# EAGLE design DeadHorsePCB_REV-B (EAGLE 8.6.1)
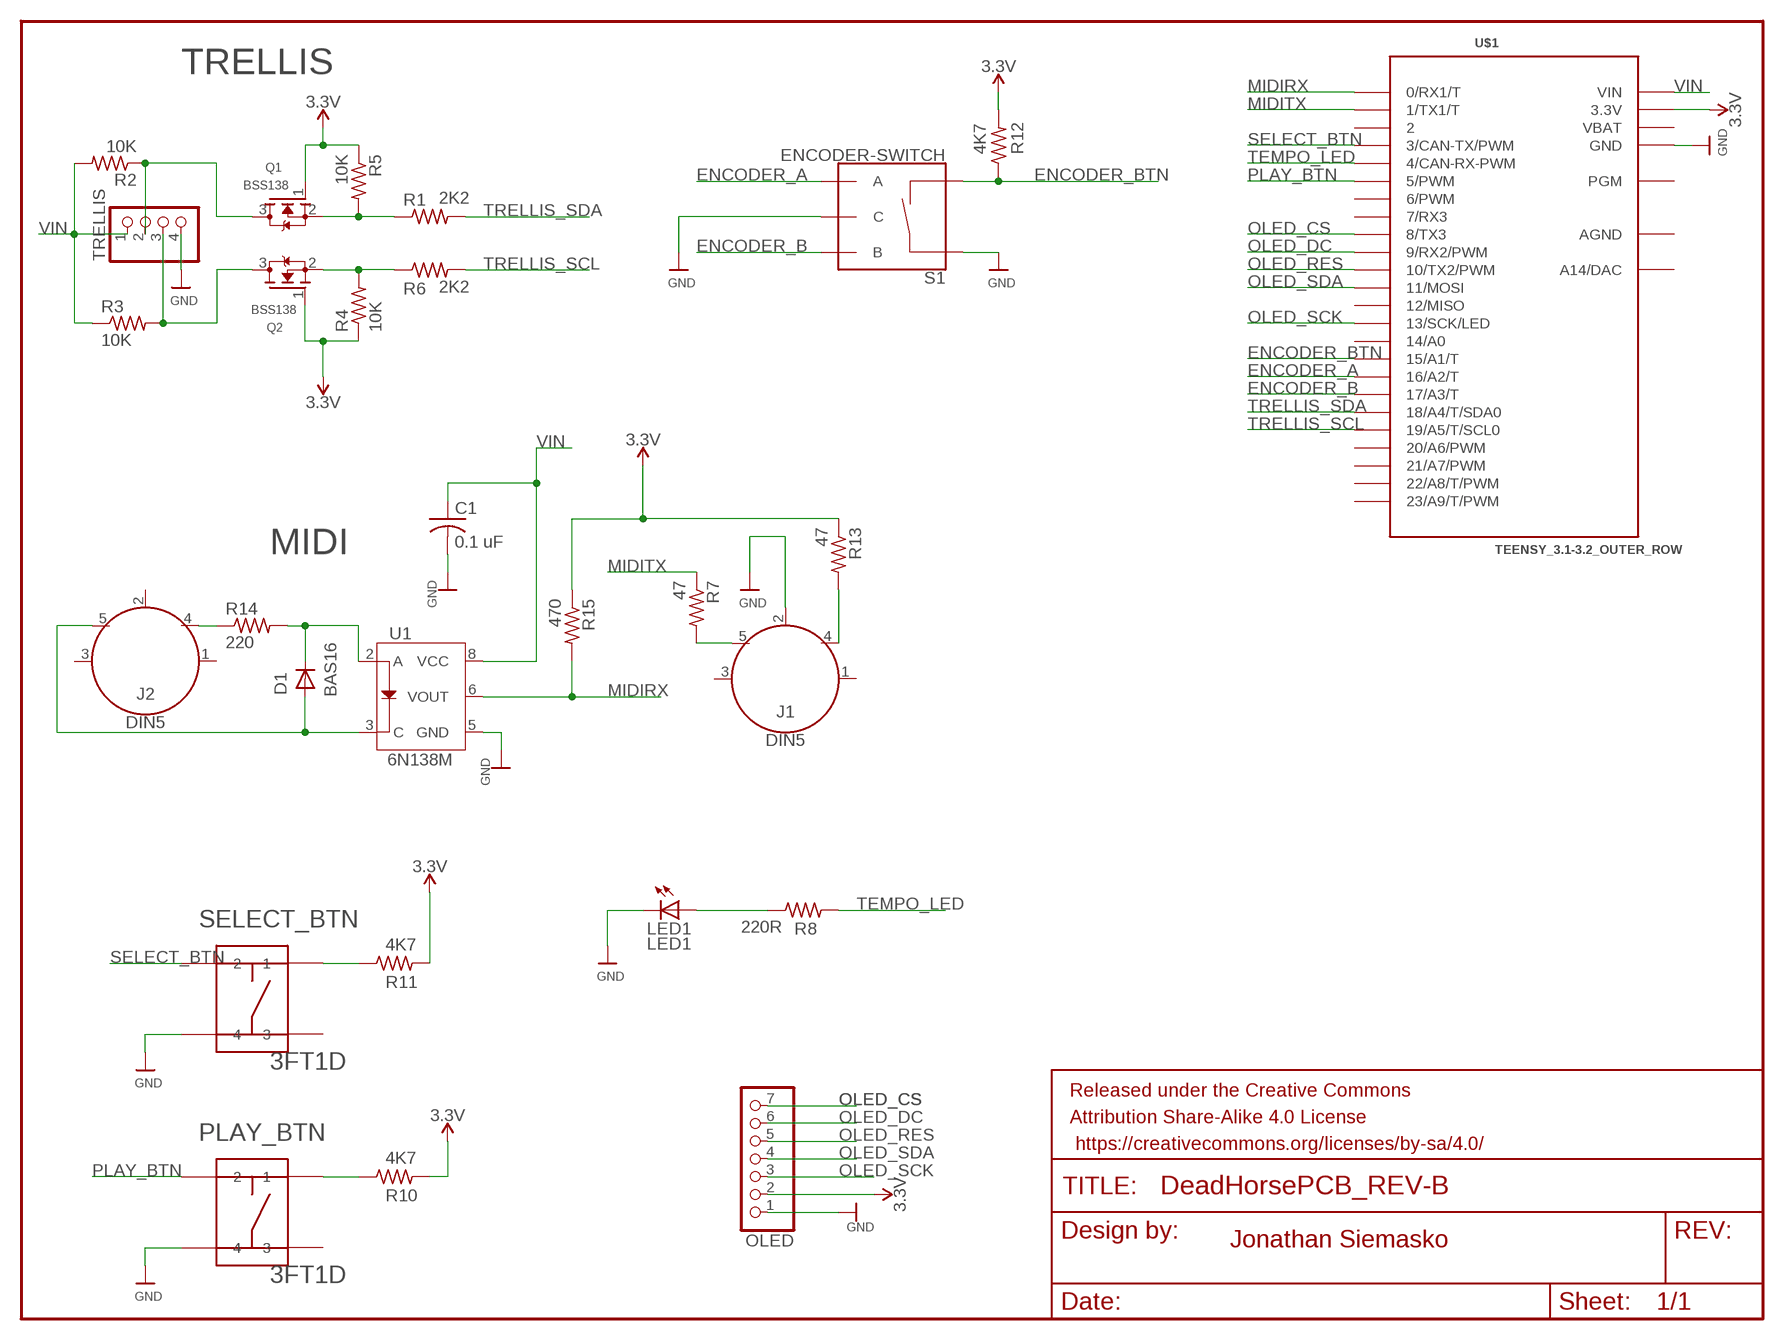
[diagram p0: schematic, sheet 1]

## Parts
C1  0.1 uF  C-USC0805  [C0805]
D1  BAS16  [SOT23]
FRAME1  FRAME-LETTER  [CREATIVE_COMMONS]
J1  DIN5  [DIN5-RA-PTH]
J2  DIN5  [DIN5-RA-PTH]
LED1  LED1  LED5MM  [LED5MM]
OLED  OLED  PINHD-1X7  [1X07]
PLAY_BTN  3FT1D  [3FT]
Q1  BSS138  MOSFET-NREFLOW  [SOT23]
Q2  BSS138  MOSFET-NREFLOW  [SOT23]
R1  2K2  R-US_R0805  [R0805]
R2  10K  R-US_R0805  [R0805]
R3  10K  R-US_R0805  [R0805]
R4  10K  R-US_R0805  [R0805]
R5  10K  R-US_R0805  [R0805]
R6  2K2  R-US_R0805  [R0805]
R7  47  R-US_R0805  [R0805]
R8  220R  R-US_R0805  [R0805]
R10  4K7  R-US_R0805  [R0805]
R11  4K7  R-US_R0805  [R0805]
R12  4K7  R-US_R0805  [R0805]
R13  47  R-US_R0805  [R0805]
R14  220  R-US_R0805  [R0805]
R15  470  R-US_R0805  [R0805]
S1  ENCODER-SWITCH  [ROTARY_ENC_PLAIN]
SELECT_BTN  3FT1D  [3FT]
TRELLIS  TRELLIS  PINHD-1X4  [1X04]
U1  6N138M  OPTO_DARL_6N138S  [8-SMD]
U$1  TEENSY_3.1-3.2_OUTER_ROW  [TEENSY_3.0-3.2&LC_OUTER_ROW]

## Nets
3.3V [3v3 supply]: OLED.2 Q1.1(G) Q2.1(G) R4.1 R5.1 R10.2 R11.2 R12.2 R13.1 R15.1 U$1.3.3V U$1.3.3V1(3.3V)
ENCODER_A: S1.A U$1.16/A2(16/A2/T)
ENCODER_B: S1.B U$1.17/A3(17/A3/T)
ENCODER_BTN: R12.1 S1.SW- U$1.15/A1(15/A1/T)
GND [supply]: C1.2 J1.2 LED1.K(C) OLED.1 PLAY_BTN.P$4 S1.C S1.SW+ SELECT_BTN.P$4 TRELLIS.4 U1.5(GND) U$1.GND U$1.GND1(GND)
MIDIRX: R15.2 U1.6(VOUT) U$1.0(0/RX1/T)
MIDITX: R7.1 U$1.1(1/TX1/T)
N$1: LED1.A R8.1
N$2: Q1.3(D) R2.1 TRELLIS.2
N$3: J1.4 R13.2
N$4: J1.5 R7.2
N$5: Q1.2(S) R1.1 R5.2
N$6: J2.4 R14.1
N$7: D1.3(K) R14.2 U1.2(A)
N$8: Q2.3(D) R3.2 TRELLIS.3
N$9: D1.1(A) J2.5 U1.3(C)
N$10: R11.1 SELECT_BTN.P$1
N$11: PLAY_BTN.P$1 R10.1
N$12: Q2.2(S) R4.2 R6.1
OLED_CS: OLED.7 U$1.8(8/TX3)
OLED_DC: OLED.6 U$1.9(9/RX2/PWM)
OLED_RES: OLED.5 U$1.10(10/TX2/PWM)
OLED_SCK: OLED.3 U$1.13(13/SCK/LED)
OLED_SDA: OLED.4 U$1.11(11/MOSI)
PLAY_BTN: PLAY_BTN.P$2 U$1.5(5/PWM)
SELECT_BTN: SELECT_BTN.P$2 U$1.3(3/CAN-TX/PWM)
TEMPO_LED: R8.2 U$1.4(4/CAN-RX-PWM)
TRELLIS_SCL: R6.2 U$1.19/A5(19/A5/T/SCL0)
TRELLIS_SDA: R1.2 U$1.18/A4(18/A4/T/SDA0)
VIN [5v supply]: C1.1 R2.2 R3.1 TRELLIS.1 U1.8(VCC) U$1.VIN
Unconnected: J1.1 J1.3 J2.1 J2.2 J2.3 PLAY_BTN.P$3 SELECT_BTN.P$3 U$1.2 U$1.6(6/PWM) U$1.7(7/RX3) U$1.12(12/MISO) U$1.14/A0 U$1.20/A6(20/A6/PWM) U$1.21/A7(21/A7/PWM) U$1.22/A8(22/A8/T/PWM) U$1.23/A9(23/A9/T/PWM) U$1.PGM U$1.RESET/DAC(A14/DAC)

## Notes on the sheet
- TRELLIS
- MIDI
- Jonathan Siemasko

## Power pins joined to a net without a drawn wire
AGND: U$1.AGND
VBAT: U$1.VBAT

## Library data of the parts
C1 = adafruit:C-US: CAPACITOR, American symbol
D1 = nxp_60:BAS16: High-speed switching diode High-speed switching diode, encapsulated in small Surface-Mounted Device (SMD) plastic packages. AAL Eindhoven MK
FRAME1 = SparkFun-Aesthetics:FRAME-LETTER: Schematic Frame - Letter Standard 8.5x11 US Letter frame
J1 J2 = SparkFun-Connectors:DIN5: DIN5 Connector - Female Right Angle (frequently used as a MIDI Jack connector) This type of connector and cable is frequently used for transmitting midi data (musical instrument digital interface). It is what you usually see on a keyboard or set of electronic drums. Learn more here <https://en.wikipedia.org/wiki/MIDI>. For more information on the pinout and electrical specifications of MIDI communications, please see the following resource: https://www.midi.org/specifications/item/midi-din-electrical-specification Here is the connector we sell at SparkFun: MIDI Connector - Female Right Angle <https://www.sparkfun.com/products/9536> (PRT-09536) Datasheet <hhttp://www.sparkfun.com/datasheets/Prototyping/Connectors/MIDI-RA.pdf> It is used on this SparkFun product: SparkFun MIDI Shield <https://www.sparkfun.com/products/12898> (DEV-12898); PROD_ID: CONN-09481
LED1 = adafruit:LED: LED OSRAM: - CHIPLED LG R971, LG N971, LY N971, LG Q971, LY Q971, LO R971, LY R971 LH N974, LH R974 LS Q976, LO Q976, LY Q976 LO Q996 - Hyper CHIPLED LW Q18S LB Q993, LB Q99A, LB R99A - SideLED LS A670, LO A670, LY A670, LG A670, LP A670 LB A673, LV A673, LT A673, LW A673 LH A674 LY A675 LS A676, LA A676, LO A676, LY A676, LW A676 LS A679, LY A679, LG A679 - Hyper Micro SIDELED® LS Y876, LA Y876, LO Y876, LY Y876 LT Y87S - SmartLED LW L88C, LW L88S LB L89C, LB L89S, LG L890 LS L89K, LO L89K, LY L89K LS L896, LA L896, LO L896, LY L896 - TOPLED LS T670, LO T670, LY T670, LG T670, LP T670 LSG T670, LSP T670, LSY T670, LOP T670, LYG T670 LG T671, LOG T671, LSG T671 LB T673, LV T673, LT T673, LW T673 LH T674 LS T676, LA T676, LO T676, LY T676, LB T676, LH T676, LSB T676, LW T676 LB T67C, LV T67C, LT T67C, LS T67K, LO T67K, LY T67K, LW E67C LS E67B, LA E67B, LO E67B, LY E67B, LB E67C, LV E67C, LT E67C LW T67C LS T679, LY T679, LG T679 LS T770, LO T770, LY T770, LG T770, LP T770 LB T773, LV T773, LT T773, LW T773 LH T774 LS E675, LA E675, LY E675, LS T675 LS T776, LA T776, LO T776, LY T776, LB T776 LHGB T686 LT T68C, LB T68C - Hyper Mini TOPLED® LB M676 - Mini TOPLED Santana® LG M470 LS M47K, LO M47K, LY M47K Source: http://www.osram.convergy.de/
OLED = pinhead:PINHD-1X7: PIN HEADER
PLAY_BTN SELECT_BTN = mec switches:3FT1D: Mulitmec - 3FT1D <http://www.mec.dk/statisk.php4?id=504> Switch 3F - Through Hole with basic matt cover http://www.mec.dk
Q1 Q2 = adafruit:MOSFET-N: N-Channel Mosfet 2N7002E - 60V 260mA SOT23 [Digikey: 2N7002ET1GOSTR-ND] - REEL BSH103 - 30V 850mA SOT23 [Digikey: 568-5013-1-ND]
R1-R8 R10-R15 = adafruit:R-US_: RESISTOR, American symbol
S1 = SparkFun-Switches:ENCODER-SWITCH: Rotary Encoder w/ Select Switch Encoders rotate similarly to potentiometers, but they’re different from potentiometers in that an encoder has full rotation without limits. They output gray code so that you can tell how much and in which direction the encoder has been turned. This encoder includes a push-down select switch built into the shaft. SparkFun Products Rotary Encoder <https://www.sparkfun.com/products/9117> (COM-09117); SF_SKU: COM-09117
TRELLIS = pinhead:PINHD-1X4: PIN HEADER
U1 = SparkFun-DiscreteSemi:OPTO_DARL_6N138S: Optoisolator, darlington pair output Optocoupler consisting of an AlGaAs LED optically coupled to a high gain split darlington photodetector. SparkFun Products: SparkFun MIDI Shield <https://www.sparkfun.com/products/12898>; PROD_ID: IC-09482
U$1 = Teensy_3_and_LC_Series_Boards_v1.4:TEENSY_3.1-3.2_OUTER_ROW: Footprint for Teensy 3.1 or 3.2 board using all pin connections on the outer perimeter

## Board
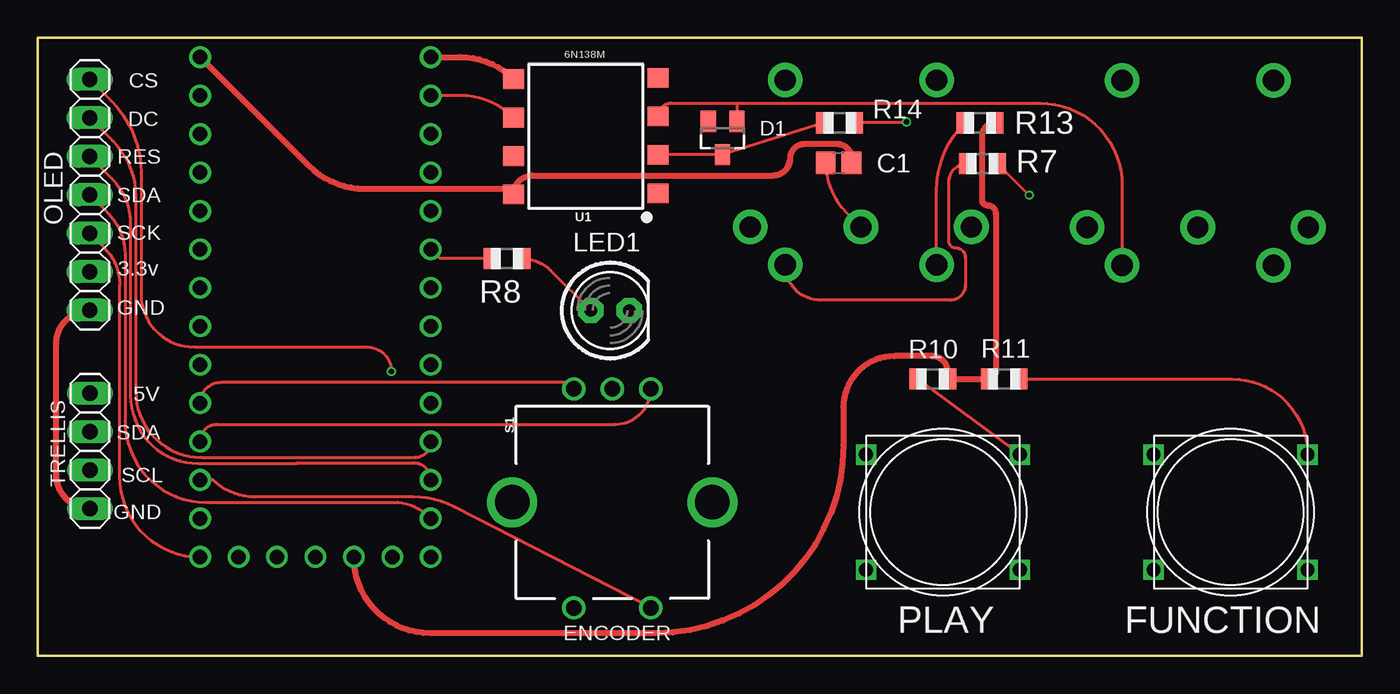
[diagram p1: board, top side]
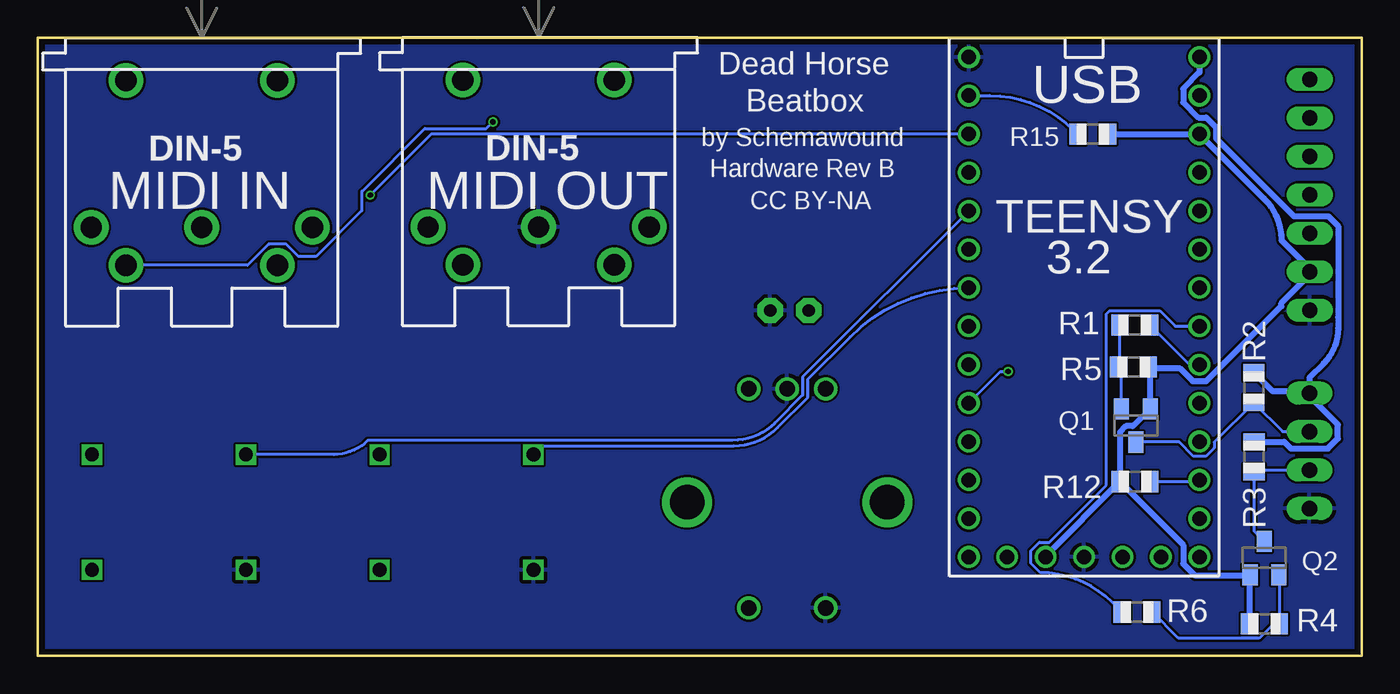
[diagram p2: board, bottom side, seen from below]

Size 87.4 x 40.81 mm. Coordinates in mm from the lower left corner, seen from the top.
Outline: 0,40.81 87.4,40.81 87.4,0 0,0 0,40.81
Copper layers (1*16): Top 0.035559375mm / dielectric 1.6mm / Bottom 0.035559375mm
Design rules "oshpark-2layer": minimum track width 6mil, minimum drill 10mil, track to track 6mil, track to pad 6mil, pad to pad 6mil, via to via 6mil, smd to smd 6mil, copper to edge 15mil, drill to drill 6mil, minimum pad ring 5mil, minimum via ring 5mil, stop-mask expansion 2.5mil, vias tented up to drill 0mil, thermal gap 10mil

### Footprints (pad centres in the part's own frame; a part is rotated, then mirrored left to right if it is on the bottom)
C0805 = smd 1.3 x 1.5: 1 -0.85,0; 2 0.85,0
SOT23 = smd 1 x 1.4: 1 -0.95,-1.1; 2 0.95,-1.1; 3 0,1.1
DIN5-RA-PTH = drill 1.4 pad 2.286: 1 7.3,12.5; 2 0,12.5; 3 -7.3,12.5; 4 5,15; 5 -5,15; 6 -5,2.8; 7 5,2.8
LED5MM = drill 0.813 pad 1.676 octagon: A -1.27,0; K 1.27,0
1X07 = drill 1.016 long: 1 -7.62,0; 2 -5.08,0; 3 -2.54,0; 4 0,0; 5 2.54,0; 6 5.08,0; 7 7.62,0
3FT = drill 0.9 square: P$1 5.08,3.81; P$2 -5.08,3.81; P$3 5.08,-3.81; P$4 -5.08,-3.81
R0805 = smd 1.1 x 1.4: 1 -1,0; 2 1,0
ROTARY_ENC_PLAIN = drill 1.016: A 7.493,-2.54; B 7.493,2.54; C 7.493,0; SW+ -6.985,2.54; SW- -6.985,-2.54 | drill 2.286: P$3 0,6.604; P$4 0,-6.604
1X04 = drill 1.016 long: 1 -3.81,0; 2 -1.27,0; 3 1.27,0; 4 3.81,0
8-SMD = smd 1.3 x 1.4: 1 -3.96,-4.96; 2 -1.42,-4.96; 3 1.12,-4.96; 4 3.66,-4.96; 5 3.59,4.58; 6 1.05,4.58; 7 -1.49,4.58; 8 -4.03,4.58
TEENSY_3.0-3.2&LC_OUTER_ROW = drill 0.965: 0 -7.62,13.97; 1 -7.62,11.43; 2 -7.62,8.89; 3 -7.62,6.35; 3.3V 7.62,11.43; 3.3V1 -2.54,-16.51; 4 -7.62,3.81; 5 -7.62,1.27; 6 -7.62,-1.27; 7 -7.62,-3.81; 8 -7.62,-6.35; 9 -7.62,-8.89; 10 -7.62,-11.43; 11 -7.62,-13.97; 12 -7.62,-16.51; 13 7.62,-16.51; 14/A0 7.62,-13.97; 15/A1 7.62,-11.43; 16/A2 7.62,-8.89; 17/A3 7.62,-6.35; 18/A4 7.62,-3.81; 19/A5 7.62,-1.27; 20/A6 7.62,1.27; 21/A7 7.62,3.81; 22/A8 7.62,6.35; 23/A9 7.62,8.89; AGND 7.62,13.97; GND -7.62,16.51; GND1 0,-16.51; PGM 2.54,-16.51; RESET/DAC 5.08,-16.51; VBAT -5.08,-16.51; VIN 7.62,16.51

### Placement (x,y rotation side)
C1  52.87,32.54 180 top
D1  45.21,34.19 180 top
FRAME1  22.88,-51.49 0 top  (outside the outline)
J1  54.34,40.82 180 bottom
J2  76.58,40.79 180 bottom
LED1  37.78,22.8 0 top
OLED  3.42,30.44 90 top
PLAY_BTN  59.76,9.48 0 top
Q1  14.91,15.21 180 bottom
Q2  6.42,6.45 0 bottom
R1  14.98,21.83 0 bottom
R2  7.12,17.71 90 bottom
R3  7.11,13.13 270 bottom
R4  6.42,2.11 0 bottom
R5  15.06,19.06 180 bottom
R6  14.83,2.89 180 bottom
R7  62.36,32.49 180 top
R8  30.97,26.23 180 top
R10  59.08,18.28 0 top
R11  63.8,18.28 180 top
R12  14.96,11.5 180 bottom
R13  62.2,35.19 180 top
R14  52.93,35.19 180 top
R15  17.76,34.45 180 bottom
S1  37.93,10.14 90 top
SELECT_BTN  78.75,9.48 0 top
TRELLIS  3.45,13.53 270 top
U1  35.98,34.49 90 top
U$1  18.32,23.03 0 bottom

### Tracks (layer width: path | path; a pad name or v marks a point on that pad's centre or on a via)
3.3V
  Top 0.406: 62.76,18.28 R10.2 60.08,18.73 arc90 59.03,19.78 56.54,19.78 arc90 53.19,16.43 53.19,13.91 arc-90 40.76,1.48 25.9,1.48 arc-90 U$1.3.3V1 | 62.76,18.28 R11.2 | R13.1 arc90 62.33,34.32 62.33,30.12 arc90 62.71,29.74 arc-90 63.25,29.21 63.25,18.77 arc-90 62.76,18.28
  Bottom 0.406: 7.42,5.3 Q2.1 | 13.96,18.97 Q1.1 15.11,15.16 15.56,15.16 15.96,14.76 R12.2 | 13.96,18.97 R5.1 | R15.1 16.75,34.46 U$1.3.3V 6.45,30.21 arc45 5.3,27.44 3.42,25.56 OLED.2 3.42,25.17 5.3,23.29 5.3,23.09 10.26,18.14 11.15,18.14 11.98,18.97 13.96,18.97 | R12.2 11.78,7.32 11.78,6.07 11.01,5.3 7.42,5.3 | R12.2 20.86,6.6 U$1.3.3V1 | 7.42,5.3 R4.1
ENCODER_A
  Top 0.2: U$1.16/A2 arc-90 11.85,15.29 38.13,15.29 arc90 S1.A
ENCODER_B
  Top 0.2: S1.B arc90 34.98,18.03 12.06,18.03 arc90 U$1.17/A3
ENCODER_BTN
  Top 0.2: U$1.15/A1 11.59,11.6 arc45 14.28,10.48 24.77,10.48 arc-27 27.48,9.83 S1.SW-
  Bottom 0.2: R12.1 10.8,11.5 U$1.15/A1
GND
  Top 0.2: C1.2 arc45 53.36,29.29 J1.2
  Top 0.406: U$1.GND 27.89,39.54 arc-45 U1.5 | TRELLIS.4 arc-90 1.22,11.95 1.22,20.62 arc-90 OLED.1
  pour Bottom: 0.46,40.66 0.46,0.53 87.07,0.53 87.07,40.66
MIDIRX
  Top 0.2: U1.6 arc45 27.89,37 U$1.0
  Bottom 0.2: U$1.0 24.55,37 arc45 19.02,34.71 R15.2
MIDITX  (via drill 0.35)
  Top 0.2: R7.1 65.42,30.43 v65.45,30.43
  Bottom 0.2: U$1.1 61.42,34.46 v65.45,30.43
N$1
  Top 0.2: R8.1 arc-45 33.86,25.45 LED1.A
N$2
  Bottom 0.2: 3.65,15.01 TRELLIS.2 5.21,14.8 R2.1 9.73,14.1 9.73,13.73 10.3,13.16 11.11,13.16 12.05,14.11 Q1.3
N$3
  Top 0.2: J1.4 59.34,30.7 arc-45 R13.2
N$4
  Top 0.2: R7.2 arc90 60.12,31.25 60.12,27.4 arc90 60.58,26.95 arc-90 61.24,26.29 61.24,24.48 arc-90 60.24,23.48 51.67,23.48 arc-90 J1.5
N$5
  Bottom 0.2: Q1.2 15.86,18.87 15.98,18.99 | 15.98,18.99 R5.2 | R1.1 15.98,18.99
N$6  (via drill 0.35)
  Top 0.2: R14.1 54,35.25 v57.35,35.25
  Bottom 0.2: v57.35,35.25 57.8,34.81 61.86,34.81 65.97,30.7 66.01,30.66 66.01,29.39 69.03,26.37 70.19,26.37 71,27.19 72.16,27.19 73.55,25.79 J2.4
N$7
  Top 0.2: U1.2 40.97,33.09 D1.3 R14.2
N$8
  Bottom 0.2: Q2.3 7.11,8.24 R3.2 6.97,12.26 TRELLIS.3
N$9
  Top 0.2: U1.3 arc-90 41.83,36.5 46.2,36.5 | J2.5 71.58,31.08 arc90 66.17,36.5 46.2,36.5 | D1.1 46.2,36.5
N$10
  Top 0.2: R11.1 78.85,18.28 arc-90 SELECT_BTN.P$1
N$11
  Top 0.2: R10.1 PLAY_BTN.P$1
N$12
  Bottom 0.2: Q2.2 5.42,5.3 R4.2 5.81,2.11 6.76,1.15 12.09,1.15 R6.1
OLED_CS  (via drill 0.35)
  Top 0.2: OLED.7 4.84,36.65 arc-45 6.81,31.88 6.81,23.87 arc90 10.29,20.39 21.72,20.39 arc-90 v23.34,18.77
  Bottom 0.2: U$1.8 23.85,18.77 v23.34,18.77 23.27,18.77
OLED_DC
  Top 0.2: OLED.6 4.93,34.02 arc-45 6.46,30.33 6.46,21.46 6.46,17.41 arc90 10.77,13.1 24.91,13.1 arc90 U$1.9
OLED_RES
  Top 0.2: OLED.5 4.89,31.52 arc-45 6.11,28.57 6.11,17.19 arc90 10.6,12.7 17.12,12.7 arc-90 17.17,12.75 24.79,12.75 arc-90 U$1.10
OLED_SCK
  Top 0.2: OLED.3 4.37,26.96 arc-45 5.4,24.46 arc90 5.38,24.44 5.38,11.84 arc90 U$1.13
OLED_SDA
  Top 0.2: OLED.4 4.61,29.26 arc-45 5.75,26.49 5.75,15.48 arc90 11.11,10.13 23.75,10.13 arc-40 25.83,9.17 U$1.11 25.94,8.67
PLAY_BTN
  Bottom 0.2: PLAY_BTN.P$2 54.1,13.87 41.45,13.87 arc-45 38.56,15.07 36.56,17.06 36.56,18.26 33.77,21.06 arc45 U$1.5
SELECT_BTN
  Bottom 0.2: U$1.3 36.91,18.41 36.91,17.21 38.73,15.39 arc45 41.55,14.22 65.61,14.22 arc45 67.85,13.29 SELECT_BTN.P$2
TEMPO_LED
  Top 0.2: R8.2 26.55,26.23 U$1.4
TRELLIS_SCL
  Bottom 0.2: R6.2 16.45,3.51 arc-45 21.21,5.48 21.84,6.11 21.84,6.92 21.27,7.5 20.61,7.5 16.86,11.25 16.86,22.56 16.64,22.79 13.33,22.79 12.3,21.76 U$1.19/A5
TRELLIS_SDA
  Bottom 0.2: R1.2 11.37,19.22 U$1.18/A4
VIN
  Top 0.406: U$1.VIN 17.87,32.37 arc45 21.57,30.84 31.03,30.84 arc-90 U1.8 arc-90 32.67,31.72 48.54,31.72 arc90 49.68,32.87 arc-90 50.62,33.81 52.76,33.81 arc-90 53.72,32.84 C1.1
  Bottom 0.406: U$1.VIN 10.7,38.53 11.78,37.45 11.78,36.55 10.77,35.54 10.26,35.54 9.62,34.91 9.62,34.17 4.47,29.02 2.2,29.02 1.54,28.37 1.54,22.36 1.55,22.36 1.55,21.63 arc45 2.51,19.31 3.45,18.37 3.45,17.48 | 3.45,17.48 TRELLIS.1 3.45,17.15 1.57,15.27 1.57,14.34 2.22,13.69 4.67,13.69 5.11,14.13 R3.1 | R2.2 5.89,17.48 3.45,17.48

### Text on the board
tPlace: CS | DC | RES | SDA | SCK | 3.3v | GND | 5V | SDA | SCL | GND
bPlace: Dead Horse | Beatbox | by Schemawound | Hardware Rev B | CC BY-NA
tNames: 6N138M | ENCODER | PLAY | FUNCTION
bNames: USB | MIDI OUT | MIDI IN | TEENSY | 3.2